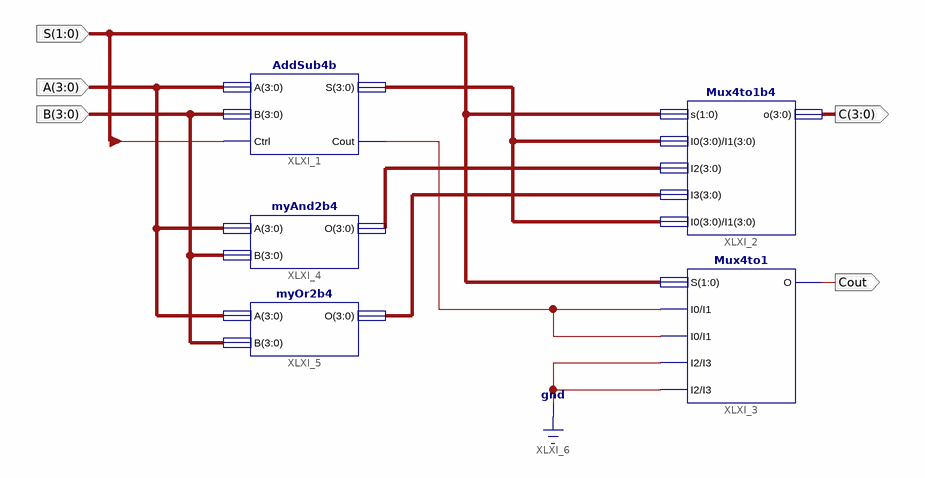
[diagram p0: schematic sheet 1]
// Xilinx ISE schematic myALU.sch (kintex7) as structural Verilog: 5 symbols, 5 ports
module myALU (
  input  [1:0] S,
  input  [3:0] A,
  input  [3:0] B,
  output Cout,
  output [3:0] C
);

  wire XLXN_7;
  wire [3:0] XLXN_4, XLXN_5, XLXN_6;

  AddSub4b XLXI_1 (.A(A), .B(B), .Ctrl(S[0]), .S(XLXN_4), .Cout(XLXN_7));
  Mux4to1b4 XLXI_2 (.s(S), .I0(XLXN_4), .I2(XLXN_5), .I3(XLXN_6), .I1(XLXN_4), .o(C));
  Mux4to1 XLXI_3 (.S(S), .I0(XLXN_7), .I1(XLXN_7), .I2(1'b0), .I3(1'b0), .O(Cout));
  myAnd2b4 XLXI_4 (.A(A), .B(B), .O(XLXN_5));
  myOr2b4 XLXI_5 (.A(A), .B(B), .O(XLXN_6));
endmodule
